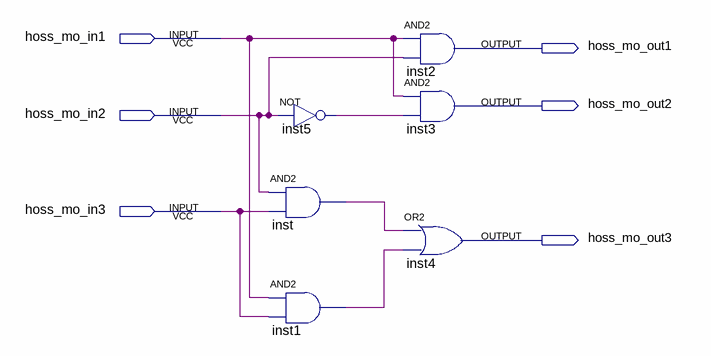
[diagram p0: schematic sheet]
// Quartus schematic supCircuitA.bdf as structural Verilog: 6 symbols, 6 pins
module supCircuitA (
  input  hoss_mo_in1,
  input  hoss_mo_in2,
  input  hoss_mo_in3,
  output hoss_mo_out1,
  output hoss_mo_out2,
  output hoss_mo_out3
);

  wire inst1_out, inst5_out, inst_out;

  not inst5 (inst5_out, hoss_mo_in2);
  and inst (inst_out, hoss_mo_in2, hoss_mo_in3);
  and inst1 (inst1_out, hoss_mo_in1, hoss_mo_in3);
  and inst2 (hoss_mo_out1, hoss_mo_in1, hoss_mo_in2);
  and inst3 (hoss_mo_out2, hoss_mo_in1, inst5_out);
  or inst4 (hoss_mo_out3, inst_out, inst1_out);
endmodule
